# Altium schematic sheet RVP_OVP_LC.SchDoc
size A
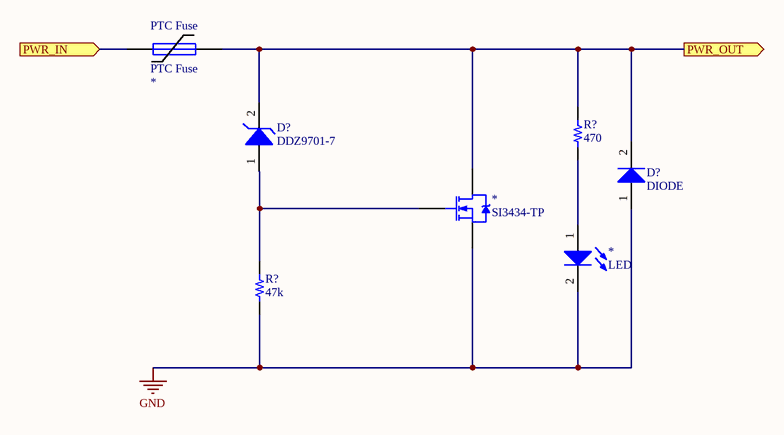
[diagram p0: RVP_OVP_LC.SchDoc]

## Parts
(Parts that share a designator on the sheet are numbered #1, #2 ... from top to bottom, then left to right.)
*#1  SI3434-TP  [SOT23-3]
*#2  LED  [0805_LED]
D?#1  DDZ9701-7  [SODFL350X115-2M]
D?#2  DIODE  [SOD-128]
PTC_Fuse  PTC Fuse  [PTC Fuse 2920/07351]
R?#1  value 470  [RES 0805/2012]  (hidden comment: Resistor 470 0805 1/10W 1%)
R?#2  value 47k  [RES 0805/2012]  (hidden comment: Resistor 47k 0805 1/10W 1%)

## Ports
PWR_IN (in), PWR_OUT (out)

## Nets
GND: *#1.2(S) *#2.2(K) D?#2.1(A) R?#2.1
PWR_IN: PTC_Fuse.1 ; port PWR_IN
PWR_OUT: *#1.3(D) D?#1.2(K) D?#2.2(K) PTC_Fuse.2 R?#1.2 ; port PWR_OUT
Net*#1_1: *#1.1(G) D?#1.1(A) R?#2.2
Net*#2_1: *#2.1(A) R?#1.1

## Library data of the parts
*#1 = 6: MOSFET N-CHANNEL 30V 5A SOT23; Manufacturer_id: 1; idFETs: 6; Value: N_Channel; Rds_On: 44Ohms; Vgs(typ): 800mV; Vgs(Max): 1V; Created_By: Angel; Drawer_id: 1; Name: SI3434-TP; Vdss: 30V; Num_Circuits: 1; Id: 5A; Package: SOT-23; MfrPartNo: SI3434-TP; Link: https://www.digikey.com/product-detail/en/micro-commercial-co/SI3434-TP/SI3434-TPMSCT-ND/7681700; Supplier1: Digi-Key
*#2 = 2: Manufacturer_id: 1; idLED: 2; Name: CMD17_0805_GREEN; Value: Green; Brightness: 7mcd; Id: 20mA; Vf: 2.1V; Drawer_id: 1; Package: 0805; Link: https://www.digikey.com/product-detail/en/visual-communications-company-vcc/CMD17-21VGD-TR8/L62505CT-ND/254936
D?#1 = 10: Zener Diode 14V 500mW ±5% Surface Mount SOD-123; Manufacturer_id: 8; idDiode: 10; Drawer_id: 1; Value: 14Vz; MfrPartNo: DDZ9701-7; Name: DDZ9701; Type: Zener; Num_Circuits: 1; Power: 500mW; Package: SOD-123; Link: https://www.digikey.com/product-detail/en/diodes-incorporated/DDZ9701-7/DDZ9701-7DICT-ND/3877402; ComponentLink1Description: Datasheet; ComponentLink1URL: https://www.diodes.com/assets/Datasheets/ds30410.pdf; Supplier1: Digi-Key; Supplier1PartNo: DDZ9701-7DICT-ND
D?#2 = 12: DIODE SCHOTTKY 30V 5A TMINIP2; Manufacturer_id: 1; idDiode: 12; Name: DB2431200L; Drawer_id: 1; Value: 5A; Type: Schottky; Num_Circuits: 1; Ic: 5A; Power: 30V; Package: SOD-128; MfrPartNo: DB2431200L; Link: https://www.digikey.com/product-detail/en/panasonic-electronic-components/DB2431200L/DB2431200LCT-ND/3884430; ComponentLink1Description: Datasheet; ComponentLink1URL: https://industrial.panasonic.com/content/data/SC/ds/ds4/DB2431200L_E.pdf; Supplier1: Digi-Key; Supplier1PartNo: DB2431200LCT-ND
PTC_Fuse = 6: Fuse; Manufacturer_id: 1; idFuse: 6; Name: 2920L500/16MR; I_hold: 5 A; I_trip: 10 A; I_max: 40 A; V_max: 16 V; Created_By: Angel; Published: 8-Jun-2000; LatestRevisionDate: 17-Jul-2002; LatestRevisionNote: Re-released for DXP Platform.; PackageReference: PIN-W2/E2.8; Publisher: Altium Limited; PackageDescription: Thru-Hole; 2 Leads; I-hold: *; Drawer_id: 1; MfrPartNo: 2920L500/16MR; Link: https://www.digikey.com/product-detail/en/littelfuse-inc/2920L500-16MR/F6136CT-ND/4147146
R?#1 = 497: Manufacturer_id: 1; idResistor: 497; Name: Res_470_0805_1/10W_1%; Created_By: Nick Mah; Supplier 1: Digi-Key; Drawer_id: 1; Tolerance: 1%; Power: 1/10W; Package: 0805; ComponentLink1Description: Datasheet; Created_Date: 2018-10-20
R?#2 = 545: Manufacturer_id: 1; idResistor: 545; Name: Res_47k_0805_1/10W_1%; Created_By: Nick Mah; Supplier 1: Digi-Key; Drawer_id: 1; Tolerance: 1%; Power: 1/10W; Package: 0805; ComponentLink1Description: Datasheet; Created_Date: 2018-10-20